# EAGLE schematic simplified_auv_power_layout_v1.0 (EAGLE 9.5.1)
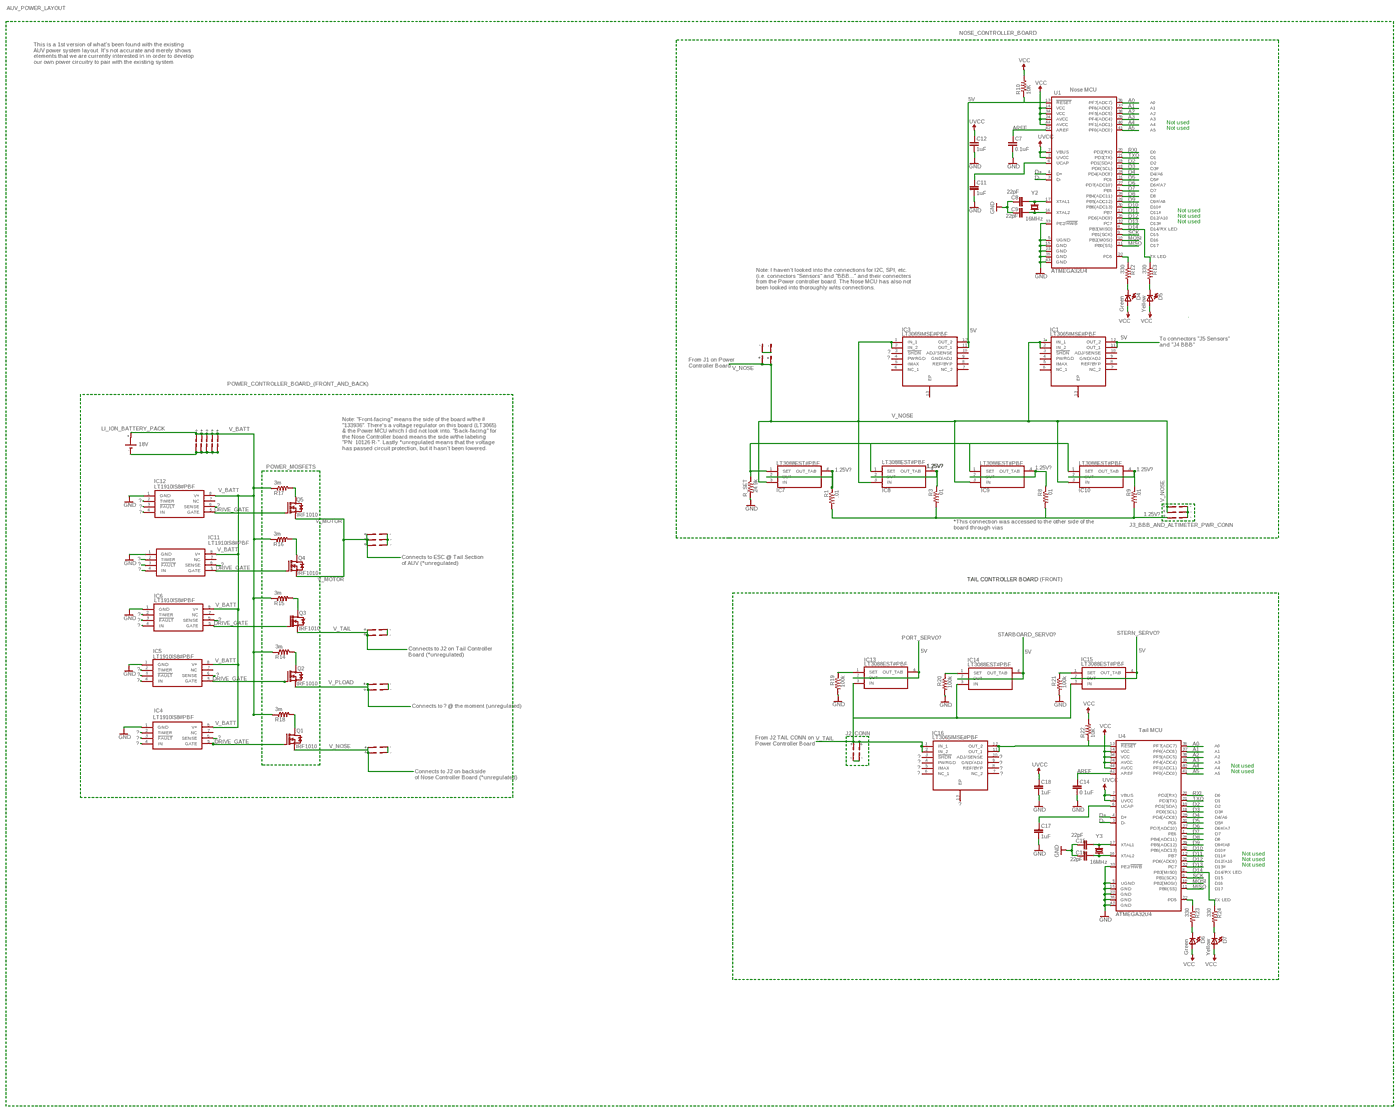
[diagram p0: schematic, sheet 1, overview]
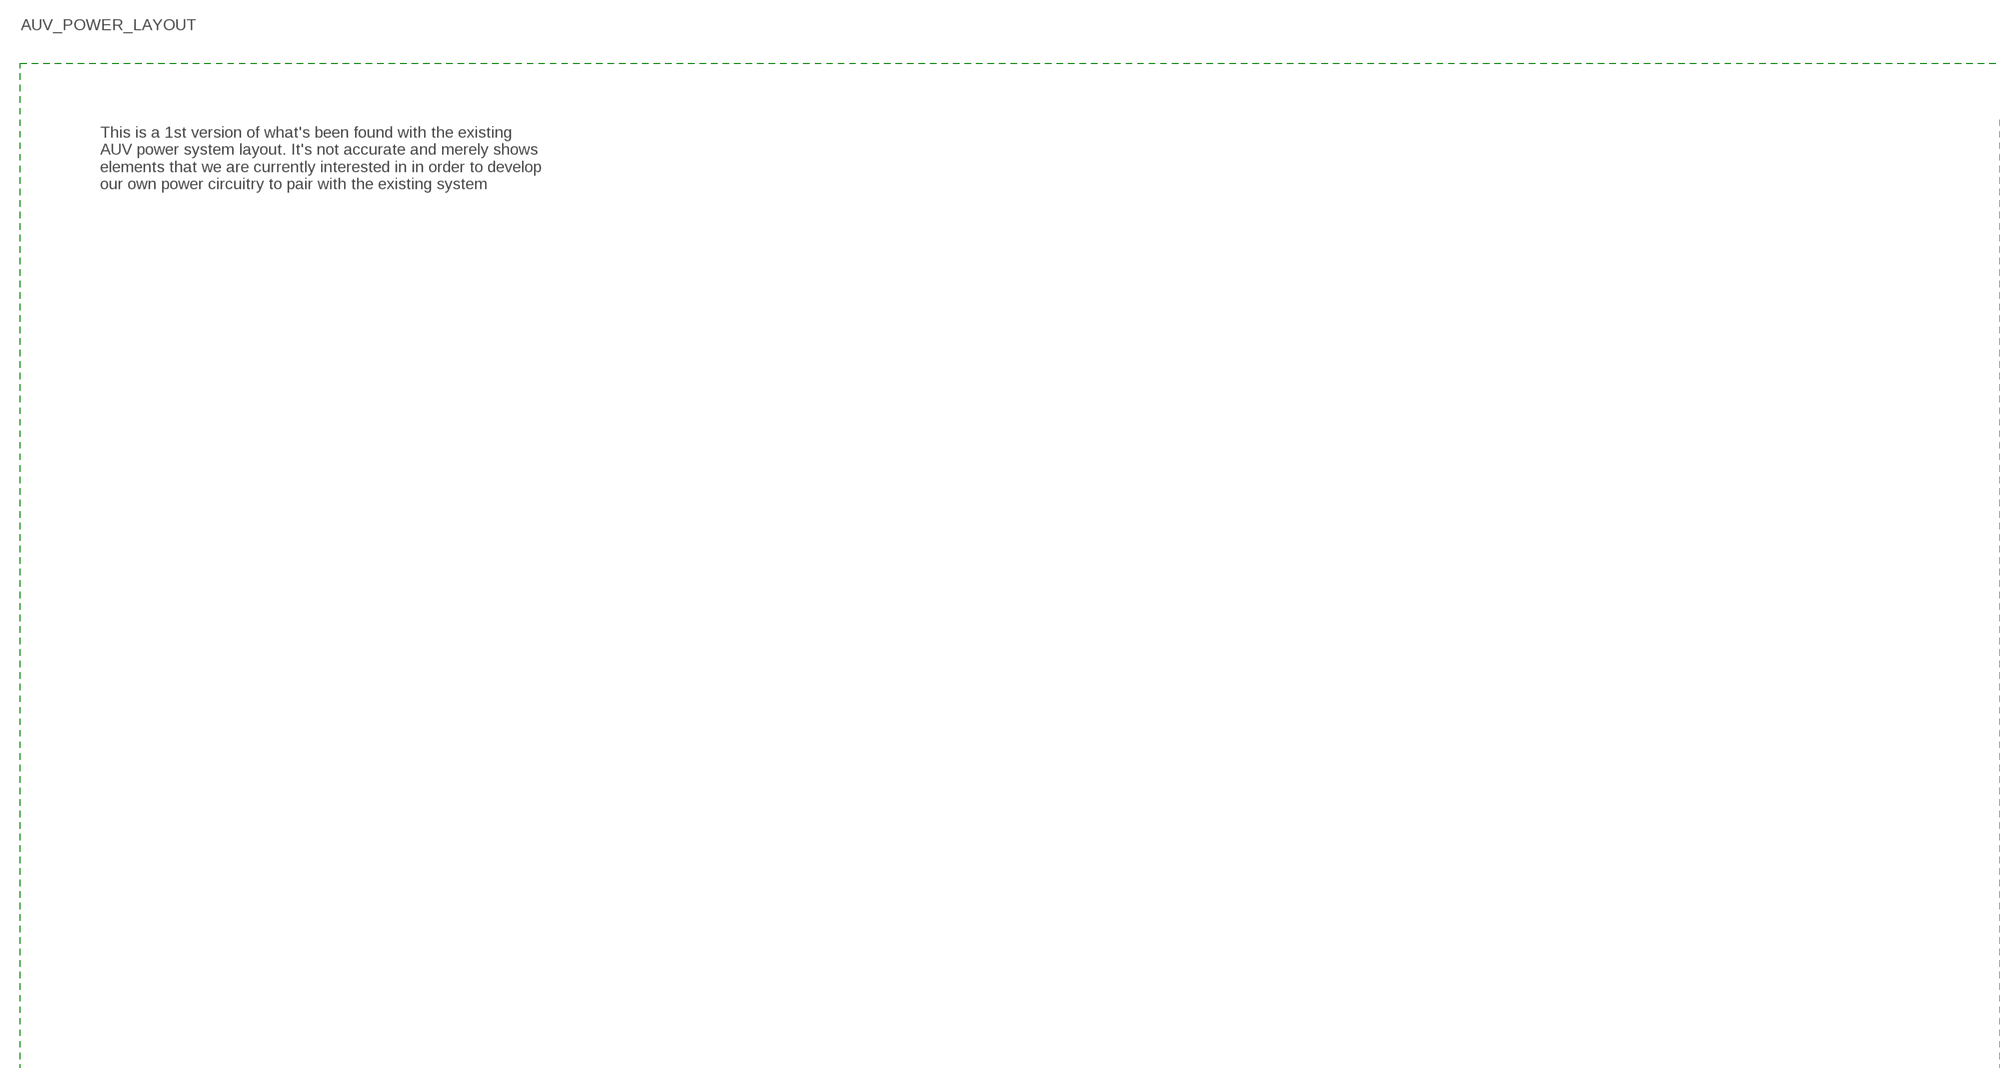
[diagram p1: schematic, sheet 1, part 1 of 4]
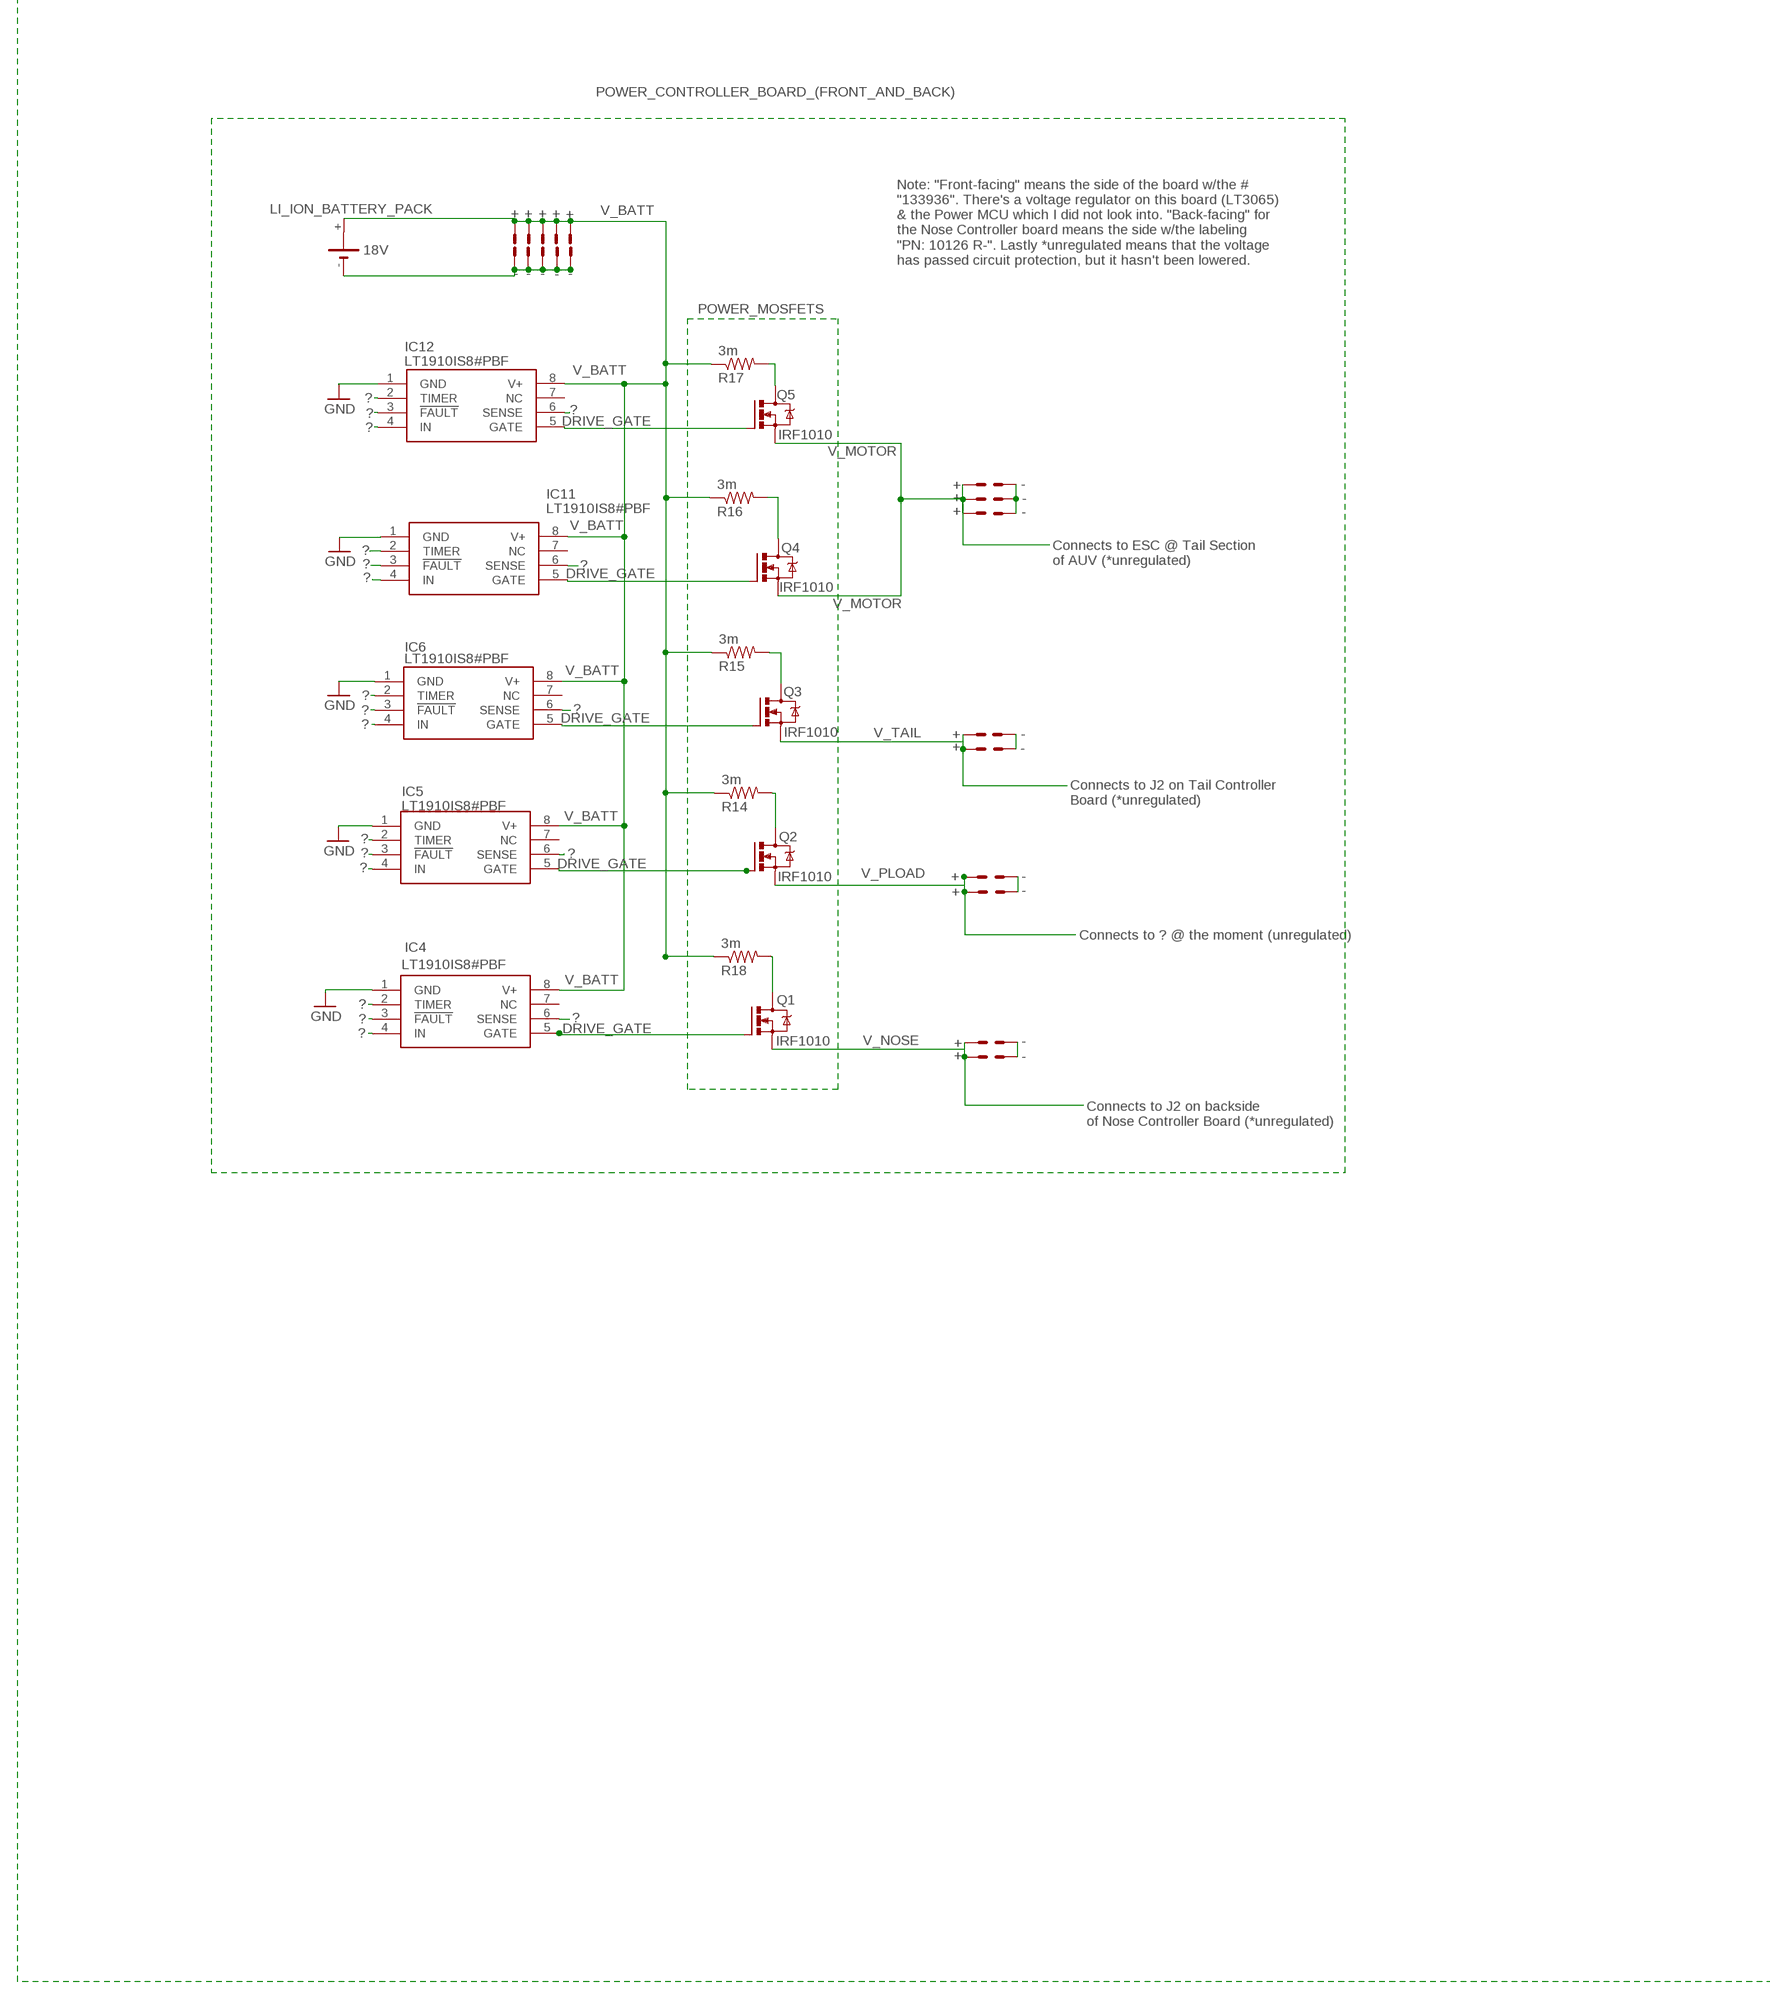
[diagram p2: schematic, sheet 1, part 2 of 4]
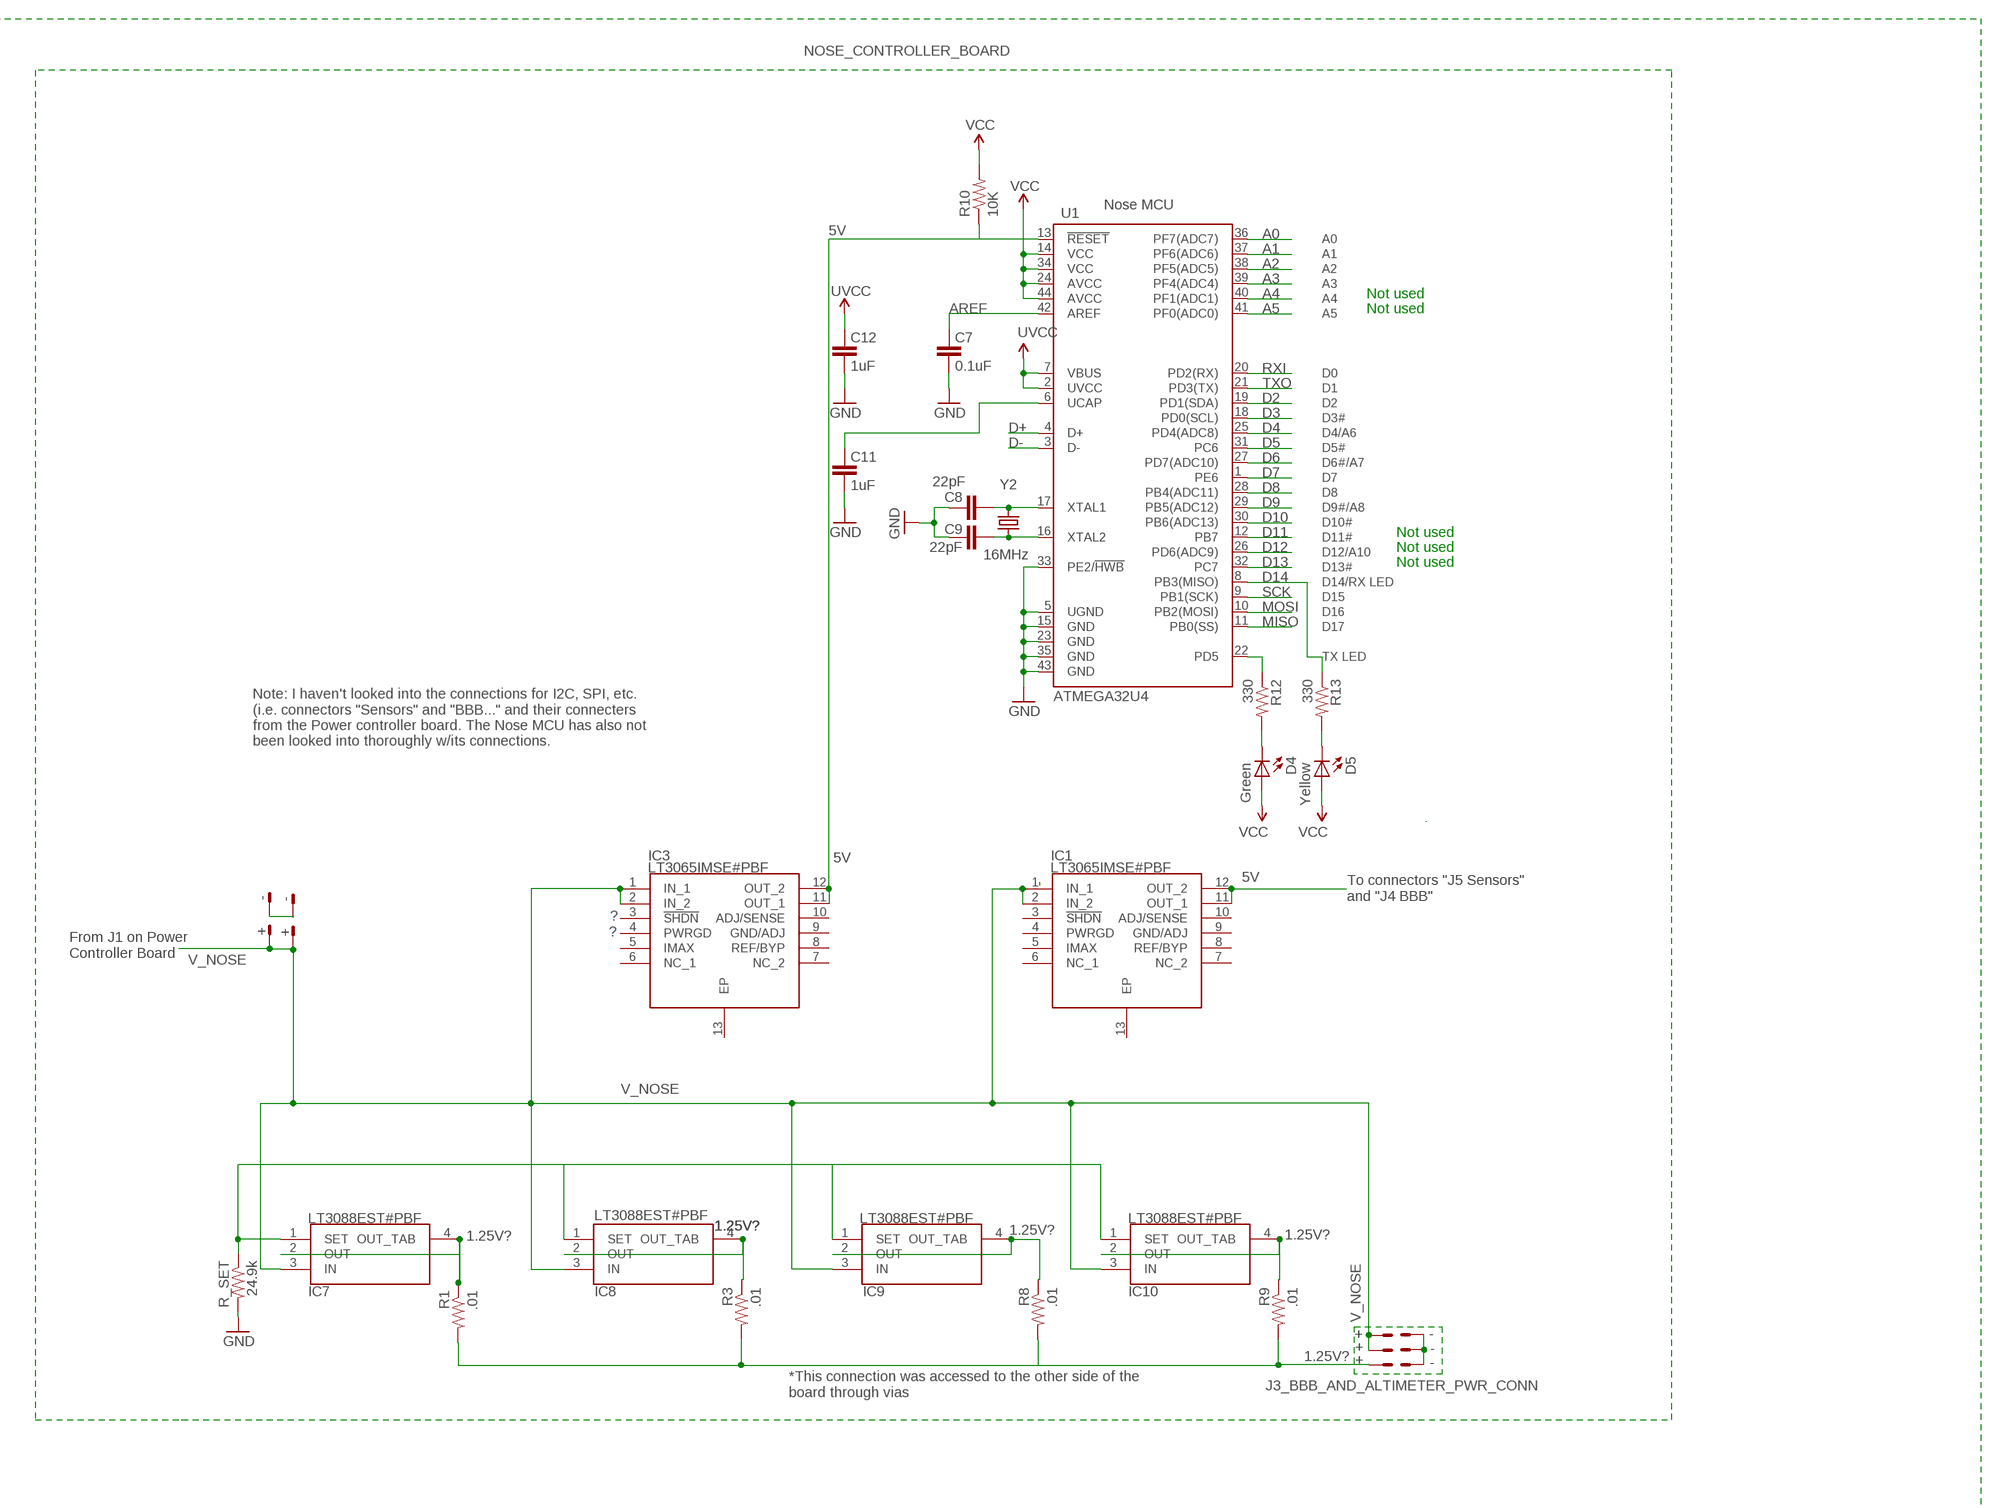
[diagram p3: schematic, sheet 1, part 3 of 4]
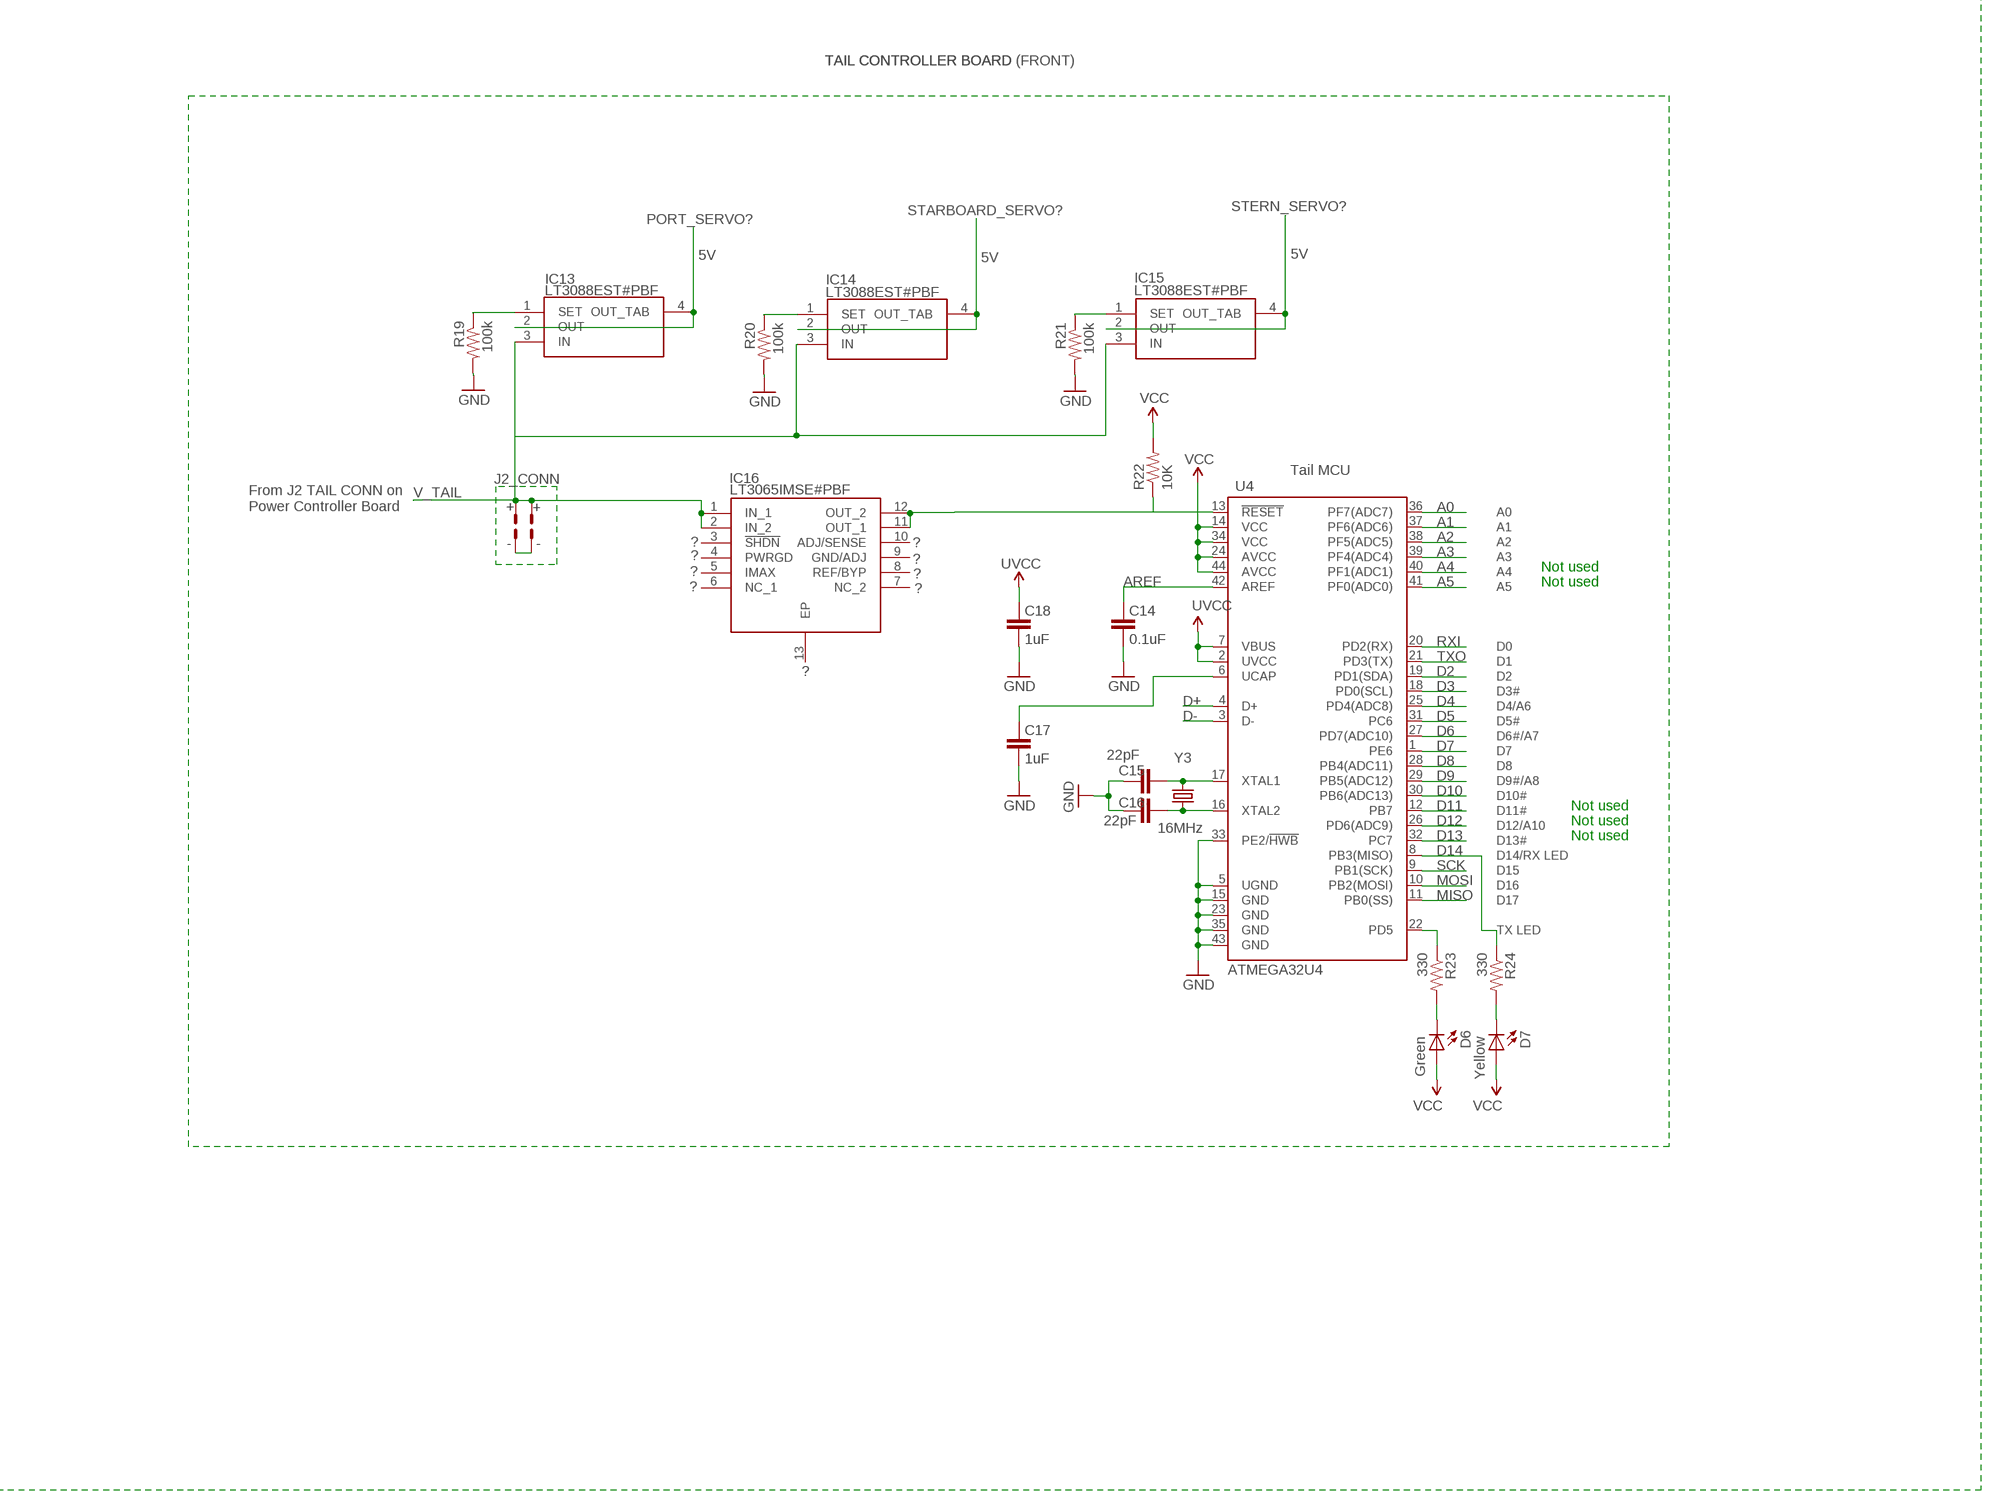
[diagram p4: schematic, sheet 1, part 4 of 4]

## Parts
C7  0.1uF  CAP0603-CAP  [0603-CAP]
C8  22pF  CAP0603-CAP  [0603-CAP]
C9  22pF  CAP0603-CAP  [0603-CAP]
C11  1uF  CAP0603-CAP  [0603-CAP]
C12  1uF  CAP0603-CAP  [0603-CAP]
C14  0.1uF  CAP0603-CAP  [0603-CAP]
C15  22pF  CAP0603-CAP  [0603-CAP]
C16  22pF  CAP0603-CAP  [0603-CAP]
C17  1uF  CAP0603-CAP  [0603-CAP]
C18  1uF  CAP0603-CAP  [0603-CAP]
D4  Green  LED0603  [LED-0603]
D5  Yellow  LED0603  [LED-0603]
D6  Green  LED0603  [LED-0603]
D7  Yellow  LED0603  [LED-0603]
IC1  LT3065IMSE#PBF  [SOP65P490X110-13N]
IC3  LT3065IMSE#PBF  [SOP65P490X110-13N]
IC4  LT1910IS8#PBF  [SOIC127P599X175-8N]
IC5  LT1910IS8#PBF  [SOIC127P599X175-8N]
IC6  LT1910IS8#PBF  [SOIC127P599X175-8N]
IC7  LT3088EST#PBF  [SOT230P700X180-4N]
IC8  LT3088EST#PBF  [SOT230P700X180-4N]
IC9  LT3088EST#PBF  [SOT230P700X180-4N]
IC10  LT3088EST#PBF  [SOT230P700X180-4N]
IC11  LT1910IS8#PBF  [SOIC127P599X175-8N]
IC12  LT1910IS8#PBF  [SOIC127P599X175-8N]
IC13  LT3088EST#PBF  [SOT230P700X180-4N]
IC14  LT3088EST#PBF  [SOT230P700X180-4N]
IC15  LT3088EST#PBF  [SOT230P700X180-4N]
IC16  LT3065IMSE#PBF  [SOP65P490X110-13N]
J4_BATTERY_CONNECTOR  J4_BATTERY  5566-10  [5566-10]
LI_ION_BATTERY_PACK  18V  CR2032H  [CR2032H]
Q1  IRF1010  IRF540  [TO220BV]
Q2  IRF1010  IRF540  [TO220BV]
Q3  IRF1010  IRF540  [TO220BV]
Q4  IRF1010  IRF540  [TO220BV]
Q5  IRF1010  IRF540  [TO220BV]
R1  .01  R-US_0414/5V  [0414V]
R3  .01  R-US_0414/5V  [0414V]
R8  .01  R-US_0414/5V  [0414V]
R9  .01  R-US_0414/5V  [0414V]
R10  10K  RESISTOR0603-RES  [0603-RES]
R12  330  RESISTOR0603-RES  [0603-RES]
R13  330  RESISTOR0603-RES  [0603-RES]
R14  3m  R-US_0414/5V  [0414V]
R15  3m  R-US_0414/5V  [0414V]
R16  3m  R-US_0414/5V  [0414V]
R17  3m  R-US_0414/5V  [0414V]
R18  3m  R-US_0414/5V  [0414V]
R19  100k  R-US_0414/5V  [0414V]
R20  100k  R-US_0414/5V  [0414V]
R21  100k  R-US_0414/5V  [0414V]
R22  10K  RESISTOR0603-RES  [0603-RES]
R23  330  RESISTOR0603-RES  [0603-RES]
R24  330  RESISTOR0603-RES  [0603-RES]
R_SET  24.9k  R-US_0414/5V  [0414V]
U1  ATMEGA32U4  ATMEGA32U4OUTFAKES  [QFN-44-NOPAD_1:1-OUTFAKES]
U4  ATMEGA32U4  ATMEGA32U4OUTFAKES  [QFN-44-NOPAD_1:1-OUTFAKES]
X3  -  87758-0216  [87758-0216]
X4  +  87758-0216  [87758-0216]
X6  52746-4  [52746-4]
X7  52746-4  [52746-4]
X8  52746-4  [52746-4]
X9  52746-4  [52746-4]
X10  52746-6  [52746-6]
X11  52746-6  [52746-6]
Y2  16MHz  CRYSTAL5X3  [CRYSTAL-SMD-5X3]
Y3  16MHz  CRYSTAL5X3  [CRYSTAL-SMD-5X3]

## Nets
1.25V?: IC7.2(OUT) IC7.4(OUT_TAB) IC8.2(OUT) IC8.4(OUT_TAB) IC9.2(OUT) IC9.4(OUT_TAB) IC10.2(OUT) IC10.4(OUT_TAB) R1.1 R3.1 R8.1 R9.1
+: IC4.8(V+) IC5.8(V+) IC6.8(V+) IC11.8(V+) IC12.8(V+) J4_BATTERY_CONNECTOR.1 J4_BATTERY_CONNECTOR.2 J4_BATTERY_CONNECTOR.3 J4_BATTERY_CONNECTOR.4 J4_BATTERY_CONNECTOR.5 LI_ION_BATTERY_PACK.+ R14.1 R15.1 R16.1 R17.1 R18.1
-: J4_BATTERY_CONNECTOR.6 J4_BATTERY_CONNECTOR.7 J4_BATTERY_CONNECTOR.8 J4_BATTERY_CONNECTOR.9 J4_BATTERY_CONNECTOR.10 LI_ION_BATTERY_PACK.-
?: IC11.2(TIMER)
A0: U1.36(PF7(ADC7)) U4.36(PF7(ADC7))
A1: U1.37(PF6(ADC6)) U4.37(PF6(ADC6))
A2: U1.38(PF5(ADC5)) U4.38(PF5(ADC5))
A3: U1.39(PF4(ADC4)) U4.39(PF4(ADC4))
A4: U1.40(PF1(ADC1)) U4.40(PF1(ADC1))
A5: U1.41(PF0(ADC0)) U4.41(PF0(ADC0))
AREF: C7.2 C14.2 U1.42(AREF) U4.42(AREF)
D2: U1.19(PD1(SDA)) U4.19(PD1(SDA))
D3: U1.18(PD0(SCL)) U4.18(PD0(SCL))
D4: U1.25(PD4(ADC8)) U4.25(PD4(ADC8))
D5: U1.31(PC6) U4.31(PC6)
D6: U1.27(PD7(ADC10)) U4.27(PD7(ADC10))
D7: U1.1(PE6) U4.1(PE6)
D8: U1.28(PB4(ADC11)) U4.28(PB4(ADC11))
D9: U1.29(PB5(ADC12)) U4.29(PB5(ADC12))
D10: U1.30(PB6(ADC13)) U4.30(PB6(ADC13))
D11: U1.12(PB7) U4.12(PB7)
D12: U1.26(PD6(ADC9)) U4.26(PD6(ADC9))
D13: U1.32(PC7) U4.32(PC7)
D14: R13.1 R24.1 U1.8(PB3(MISO)) U4.8(PB3(MISO))
D+: U1.4(D+) U4.4(D+)
D-: U1.3(D-) U4.3(D-)
DRIVE_GATE: IC5.5(GATE) Q2.G
GND [vcc]: C7.1 C8.2 C9.2 C11.1 C12.1 C14.1 C15.2 C16.2 C17.1 C18.1 IC4.1(GND) IC5.1(GND) IC6.1(GND) IC11.1(GND) IC12.1(GND) R19.2 R20.2 R21.2 R_SET.2 U1.5(UGND) U1.15(GND) U1.23(GND) U1.33(PE2/!HWB) U1.35(GND) U1.43(GND) U4.5(UGND) U4.15(GND) U4.23(GND) U4.33(PE2/!HWB) U4.35(GND) U4.43(GND)
MISO: U1.11(PB0(SS)) U4.11(PB0(SS))
MOSI: U1.10(PB2(MOSI)) U4.10(PB2(MOSI))
N$9: IC12.2(TIMER)
N$10: IC4.5(GATE) Q1.G
N$11: C16.1 U4.16(XTAL2) Y3.1
N$12: IC6.5(GATE) Q3.G
N$13: IC7.1(SET) IC8.1(SET) IC9.1(SET) IC10.1(SET) R_SET.1
N$15: R1.2 R3.2 R8.2 R9.2 X11.1
N$18: IC1.11(OUT_1) IC1.12(OUT_2)
N$19: C9.1 U1.16(XTAL2) Y2.1
N$20: C8.1 U1.17(XTAL1) Y2.3
N$21: C11.2 U1.6(UCAP)
N$23: X3.1 X3.2
N$24: D5.C R13.2
N$25: D4.C R12.2
N$26: IC11.5(GATE) Q4.G
N$27: IC12.5(GATE) Q5.G
N$28: Q5.D R17.2
N$29: Q4.D R16.2
N$30: Q3.D R15.2
N$31: Q2.D R14.2
N$32: Q1.D R18.2
N$33: X7.1 X7.2
N$34: IC12.3(!FAULT)
N$35: X8.3 X8.4
N$36: X8.1 X8.2
N$37: X6.1 X6.2
N$39: X7.3 X7.4
N$40: X6.3 X6.4
N$41: IC12.4(IN)
N$42: IC6.4(IN)
N$43: X10.4 X10.5 X10.6
N$44: IC6.3(!FAULT)
N$45: IC6.2(TIMER)
N$46: IC5.2(TIMER)
N$47: IC5.3(!FAULT)
N$48: IC5.4(IN)
N$49: IC4.4(IN)
N$50: IC4.3(!FAULT)
N$51: IC4.2(TIMER)
N$52: IC5.6(SENSE)
N$53: IC4.6(SENSE)
N$54: IC6.6(SENSE)
N$55: IC11.6(SENSE)
N$56: IC12.6(SENSE)
N$57: IC11.3(!FAULT)
N$58: IC11.4(IN)
N$59: IC16.11(OUT_1) IC16.12(OUT_2)
N$60: C15.1 U4.17(XTAL1) Y3.3
N$61: IC15.1(SET) R21.1
N$62: IC14.1(SET) R20.1
N$63: IC13.1(SET) R19.1
N$64: C17.2 U4.6(UCAP)
N$65: D7.C R24.2
N$66: X9.3 X9.4
N$67: D6.C R23.2
N$68: X11.4 X11.5 X11.6
N$71: IC3.11(OUT_1) IC3.12(OUT_2)
PORT_SERVO?: IC13.2(OUT) IC13.4(OUT_TAB)
RESET1: R10.1 U1.13(!RESET)
RESET2: R22.1 U4.13(!RESET)
RXI: U1.20(PD2(RX)) U4.20(PD2(RX))
SCK: U1.9(PB1(SCK)) U4.9(PB1(SCK))
STARBOARD_SERVO?: IC14.2(OUT) IC14.4(OUT_TAB)
STERN_SERVO?: IC15.2(OUT) IC15.4(OUT_TAB)
TXLED1: R12.1 U1.22(PD5)
TXLED2: R23.1 U4.22(PD5)
TXO: U1.21(PD3(TX)) U4.21(PD3(TX))
UVCC: C12.2 C18.2 U1.2(UVCC) U1.7(VBUS) U4.2(UVCC) U4.7(VBUS)
V_MOTOR: Q4.S Q5.S X10.1 X10.2 X10.3
V_NOSE: IC1.1(IN_1) IC1.2(IN_2) IC3.1(IN_1) IC3.2(IN_2) IC7.3(IN) IC8.3(IN) IC9.3(IN) IC10.3(IN) Q1.S X4.1 X4.2 X11.2 X11.3
V_PLOAD: Q2.S
V_TAIL: IC13.3(IN) IC14.3(IN) IC15.3(IN) IC16.1(IN_1) IC16.2(IN_2) Q3.S X9.1 X9.2
VCC: D4.A D5.A D6.A D7.A R10.2 R22.2 U1.14(VCC) U1.24(AVCC) U1.34(VCC) U1.44(AVCC) U4.14(VCC) U4.24(AVCC) U4.34(VCC) U4.44(AVCC)
Unconnected: IC1.3(!SHDN) IC1.4(PWRGD) IC1.5(IMAX) IC1.6(NC_1) IC1.7(NC_2) IC1.8(REF/BYP) IC1.9(GND/ADJ) IC1.10(ADJ/SENSE) IC1.13(EP) IC3.3(!SHDN) IC3.4(PWRGD) IC3.5(IMAX) IC3.6(NC_1) IC3.7(NC_2) IC3.8(REF/BYP) IC3.9(GND/ADJ) IC3.10(ADJ/SENSE) IC3.13(EP) IC4.7(NC) IC5.7(NC) IC6.7(NC) IC11.7(NC) IC12.7(NC) IC16.3(!SHDN) IC16.4(PWRGD) IC16.5(IMAX) IC16.6(NC_1) IC16.7(NC_2) IC16.8(REF/BYP) IC16.9(GND/ADJ) IC16.10(ADJ/SENSE) IC16.13(EP) LI_ION_BATTERY_PACK.+@1(+)

## Notes on the sheet
- This is a 1st version of what's been found with the existing
  AUV power system layout. It's not accurate and merely shows
  elements that we are currently interested in in order to develop
  our own power circuitry to pair with the existing system
- Nose MCU
- 5V
- Not used
- Not used
- Not used
- Not used
- Not used
- Note: I haven't looked into the connections for I2C, SPI, etc. 
  (i.e. connectors "Sensors" and "BBB..." and their connecters 
  from the Power controller board. The Nose MCU has also not 
  been looked into thoroughly w/its connections.
- 5V
- 5V
- To connectors "J5 Sensors" 
  and "J4 BBB"
- ?
- ?
- From J1 on Power
  Controller Board
- V_BATT
- Note: "Front-facing" means the side of the board w/the #
  "133936". There's a voltage regulator on this board (LT3065)
  & the Power MCU which I did not look into. "Back-facing" for 
  the Nose Controller board means the side w/the labeling 
  "PN: 10126 R-". Lastly *unregulated means that the voltage
  has passed circuit protection, but it hasn't been lowered.
- V_BATT
- + | -
- + | -
- + | -
- *This connection was accessed to the other side of the 
  board through vias
- + | -
- + | -
- + | -
- V_BATT
- Connects to ESC @ Tail Section 
  of AUV (*unregulated)
- TAIL CONTROLLER BOARD | TAIL CONTROLLER BOARD (FRONT)
- V_BATT
- + | -
- + | -
- 5V | 5V | 5V
- Connects to J2 on Tail Controller 
  Board (*unregulated)
- V_BATT
- + | -
- + | -
- Connects to ? @ the moment (unregulated)
- V_BATT
- Tail MCU
- From J2 TAIL CONN on 
  Power Controller Board
- + | +
- + | -
- + | -
- - | - | ? | ?
- ? | ?
- Not used
- ? | ?
- Not used
- ? | ?
- Connects to J2 on backside 
  of Nose Controller Board (*unregulated)
- ?
- Not used
- Not used
- Not used

## Library data of the parts
C7-C9 C11 C12 C14-C18 = SparkFun:CAP: Capacitor Standard 0603 ceramic capacitor, and 0.1" leaded capacitor.
D4-D7 = SparkFun:LED: LEDs Standard schematic elements and footprints for 5mm, 3mm, 1206, and 0603 sized LEDs. 5mm - Spark Fun Electronics SKU : COM-00529 (and others)
IC1 IC3 IC16 = SamacSys_Parts:LT3065IMSE#PBF: LINEAR TECHNOLOGY - LT3065IMSE#PBF - LDO, ADJ O/P, 0.6V-40V, 0.5A, MSOP-12 Source: Datasheet <http://cds.linear.com/docs/en/datasheet/3065fb.pdf>; DESCRIPTION: LINEAR TECHNOLOGY - LT3065IMSE#PBF - LDO, ADJ O/P, 0.6V-40V, 0.5A, MSOP-12; HEIGHT: 1.1mm; MANUFACTURER_NAME: Linear Technology; MANUFACTURER_PART_NUMBER: LT3065IMSE#PBF; MOUSER_PART_NUMBER: 584-LT3065IMSE#PBF; MOUSER_PRICE-STOCK: https://www.mouser.com/Search/Refine.aspx?Keyword=584-LT3065IMSE%23PBF
IC4-IC6 IC11 IC12 = SamacSys_Parts:LT1910IS8#PBF: Linear Technology LT1910IS8#PBF, MOSFET Power Driver,, 8 48 V, Non-Inverting, 8-Pin SOIC Source: Datasheet <http://cds.linear.com/docs/en/datasheet/1910fc.pdf>; DESCRIPTION: Linear Technology LT1910IS8#PBF, MOSFET Power Driver,, 8 48 V, Non-Inverting, 8-Pin SOIC; HEIGHT: 1.752mm; MANUFACTURER_NAME: Linear Technology; MANUFACTURER_PART_NUMBER: LT1910IS8#PBF; MOUSER_PART_NUMBER: 584-LT1910IS8#PBF; MOUSER_PRICE-STOCK: https://www.mouser.com/Search/Refine.aspx?Keyword=584-LT1910IS8%23PBF; RS_PART_NUMBER: 7799502; RS_PRICE-STOCK: https://uk.rs-online.com/web/p/products/7799502
IC7-IC10 IC13-IC15 = SamacSys_Parts:LT3088EST#PBF: 800mA Single Resistor Rugged Linear Regulator Source: Datasheet <http://cds.linear.com/docs/en/datasheet/3088fb.pdf>; DESCRIPTION: 800mA Single Resistor Rugged Linear Regulator; HEIGHT: 1.8mm; MANUFACTURER_NAME: Linear Technology; MANUFACTURER_PART_NUMBER: LT3088EST#PBF; MOUSER_PART_NUMBER: 584-LT3088EST#PBF; MOUSER_PRICE-STOCK: https://www.mouser.com/Search/Refine.aspx?Keyword=584-LT3088EST%23PBF
J4_BATTERY_CONNECTOR = con-molex:5566-10: Mini FIT connector 10 pol Source: http://www.molex.com; MF: MOLEX; OC_FARNELL: unknown; OC_NEWARK: unknown
LI_ION_BATTERY_PACK = battery:CR2032H: LI BATTERY Varta
Q1-Q5 = transistor-power:IRF540: HEXFET Power MOSFET
R1 R3 R8 R9 R14-R21 R_SET = rcl:R-US_: RESISTOR, American symbol; SPICEPREFIX: R
R10 R12 R13 R22-R24 = SparkFun:RESISTOR: Resistor Basic schematic elements and footprints for 0603, 1206, and PTH resistors.
U1 U4 = Testing:ATMEGA32U4: Atmel 44-pin 8-bit Microcontroller with 32KBytes of ISP Flash and USB Controller
X3 X4 = con-molex:87758-0216: 2 Pin - 2mm Dual Row Single Wafer, Vertical T/H HDR Source: http://www.molex.com/pdm_docs/sd/877580616_sd.pdf; MF: MOLEX; MPN: 87758-0216; OC_FARNELL: unknown; OC_NEWARK: 94M1513
X6-X9 = con-molex:52746-4: FPC Connector ZIF for SMT 0.5mm Source: http://www.farnell.com/datasheets/73044.pdf [DWG. NO. (Sheet 1 OF 2) SD-52746-**17]; MF: MOLEX; MPN: 52746-442; OC_FARNELL: unknown; OC_NEWARK: 55R0391
X10 X11 = con-molex:52746-6: FPC Connector ZIF for SMT 0.5mm Source: http://www.farnell.com/datasheets/73044.pdf [DWG. NO. (Sheet 1 OF 2) SD-52746-**17]; MF: MOLEX; OC_FARNELL: unknown; OC_NEWARK: unknown
Y2 Y3 = SparkFun:CRYSTAL: Crystals Various standard crystals. Proven footprints. Spark Fun Electronics SKU : COM-00534

## Net classes
0 default: width 0.203 mm